# EAGLE design TimeBoard (EAGLE 8.5.2)
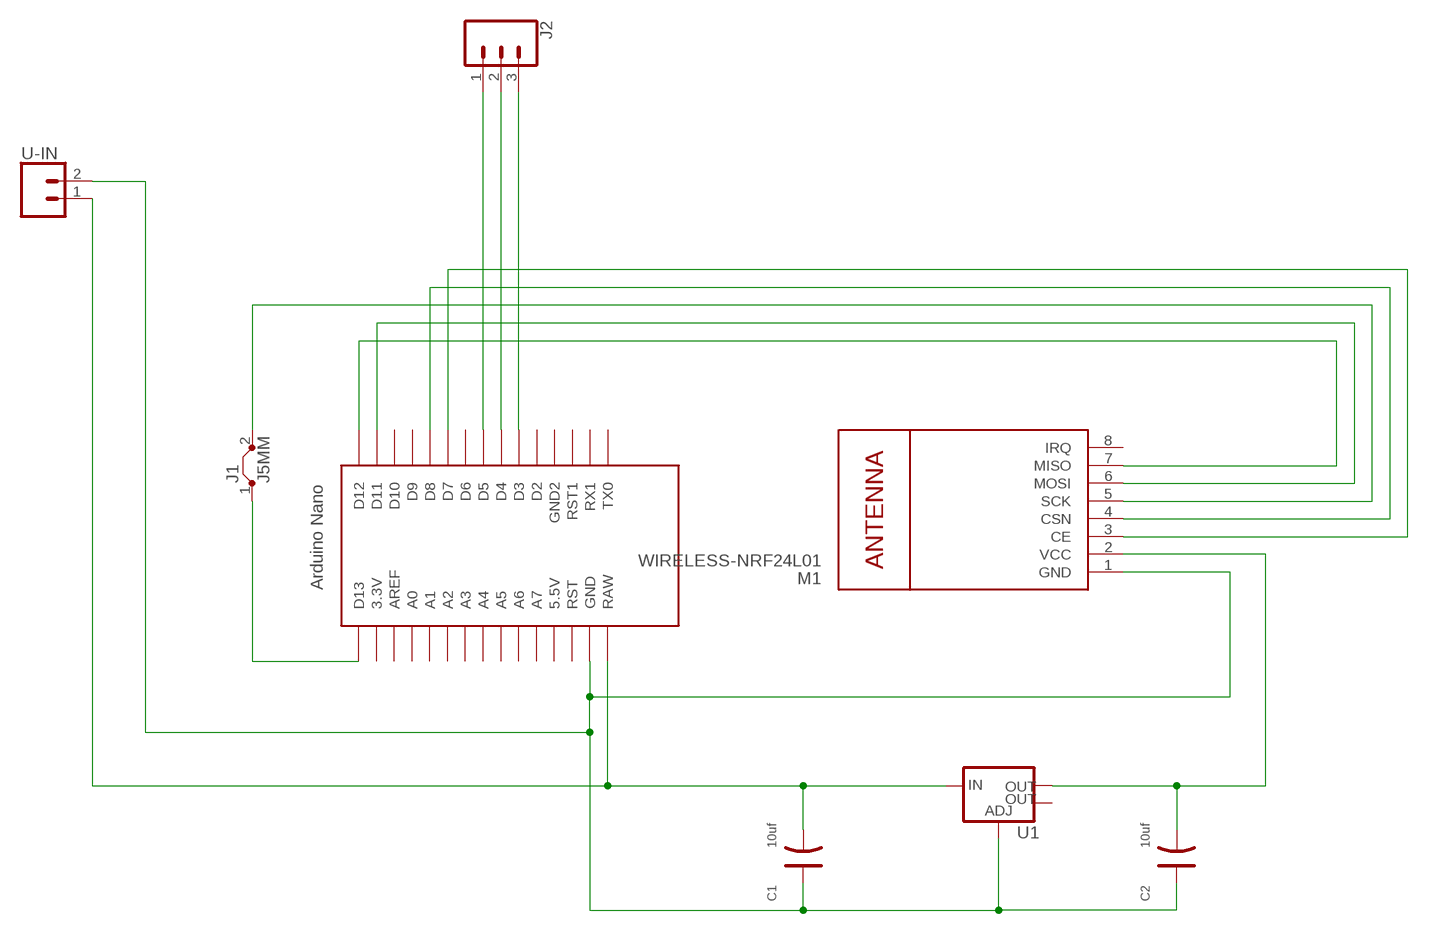
[diagram p0: schematic, sheet 1]

## Parts
C1  10uf  TANTALUM-SMD-10UF-16V-10%(AVX-B)  [AVX-B]
C2  10uf  TANTALUM-SMD-10UF-16V-10%(AVX-B)  [AVX-B]
J1  J5MM  [05]
J2  CONN_03-SCREW-5MM  [SCREWTERMINAL-5MM-3]
M1  WIRELESS-NRF24L01  [WIRELESS-NRF24L01]
U1  V_REG_LM1117SOT223  [SOT223]
U$1  NANO  [NANO]
U-IN  CONN_025MM  [SCREWTERMINAL-5MM-2]

## Nets
N$1: M1.4(CSN) U$1.D8
N$2: C1.+ C2.+ M1.1(GND) U1.1(ADJ) U$1.GND U-IN.2
N$3: C2.- M1.2(VCC) U1.2(OUT)
N$4: J1.2 M1.5(SCK)
N$5: J2.3 U$1.D3
N$6: J2.2 U$1.D4
N$7: J2.1 U$1.D5
N$11: C1.- U1.3(IN) U$1.RAW U-IN.1
N$15: M1.3(CE) U$1.D7
N$16: M1.6(MOSI) U$1.D11
N$17: M1.7(MISO) U$1.D12
N$21: J1.1 U$1.D13
Unconnected: M1.8(IRQ) U1.4(OUT) U$1.3.3V U$1.5V(5.5V) U$1.A0 U$1.A1 U$1.A2 U$1.A3 U$1.A4 U$1.A5 U$1.A6 U$1.A7 U$1.AREF U$1.D2 U$1.D6 U$1.D9 U$1.D10 U$1.GND1(GND2) U$1.ICSP1 U$1.ICSP2 U$1.ICSP3 U$1.ICSP4 U$1.ICSP5 U$1.ICSP6 U$1.RST U$1.RST1 U$1.RX1 U$1.TX0

## Library data of the parts
C1 C2 = Seeed-Capacitor:TANTALUM-SMD-10UF-16V-10%(AVX-B): 302020019; MPN: TAJB106K016RNJ
J1 = jumper:J: Bridge
J2 = SparkFun-Connectors:CONN_03: Multi connection point. Often used as Generic Header-pin footprint for 0.1 inch spaced/style header connections On any of the 0.1 inch spaced packages, you can populate with these: Break Away Headers - Straight <https://www.sparkfun.com/products/116> (PRT-00116) Break Away Male Headers - Right Angle <https://www.sparkfun.com/products/553> (PRT-00553) Female Headers <https://www.sparkfun.com/products/115> (PRT-00115) Break Away Headers - Machine Pin <https://www.sparkfun.com/products/117> (PRT-00117) Break Away Female Headers - Swiss Machine Pin <https://www.sparkfun.com/products/743> (PRT-00743) Stackable Header - 3 Pin (Female, 0.1") <https://www.sparkfun.com/products/13875> (PRT-13875) For SCREWTERMINALS and SPRING TERMINALS visit here: Screw Terimnals on SparkFun.com <https://www.sparkfun.com/search/results?term=Screw+Terminals> (5mm/3.5mm/2.54mm spacing) This device is also useful as a general connection point to wire up your design to another part of your project. Our various solder wires solder well into these plated through hole pads. Hook-Up Wire - Assortment (Stranded, 22 AWG) <https://www.sparkfun.com/products/11375> (PRT-11375) Hook-Up Wire - Assortment (Solid Core, 22 AWG) <https://www.sparkfun.com/products/11367> (PRT-11367) View the entire wire category on our website here <https://www.sparkfun.com/categories/141> Special notes: Molex polarized connector foot print use with SKU : PRT-08232 with associated crimp pins and housings.; PROD_ID: CONN-10134; SF_SKU: PRT-08433
M1 = diy-modules:WIRELESS-NRF24L01: 2.4 GHz Wireless Module based on NRF24L01 chip More details available here: http://www.electrodragon.com/w/NRF24L01 Click here to find device on ebay.com <http://www.ebay.com/sch/nrf24l01+arduino>
U1 = SparkFun-IC-Power:V_REG_LM1117: Voltage Regulator LM1117 Standard adjustable voltage regulator but in SMD form. Spark Fun Electronics SKU : COM-00595; PROD_ID: VREG-08170
U$1 = Arduino-clone:NANO: Arduino Nano
U-IN = SparkFun-Connectors:CONN_02: Multi connection point. Often used as Generic Header-pin footprint for 0.1 inch spaced/style header connections On any of the 0.1 inch spaced packages, you can populate with these: Break Away Headers - Straight <https://www.sparkfun.com/products/116> (PRT-00116) Break Away Male Headers - Right Angle <https://www.sparkfun.com/products/553> (PRT-00553) Female Headers <https://www.sparkfun.com/products/115> (PRT-00115) Break Away Headers - Machine Pin <https://www.sparkfun.com/products/117> (PRT-00117) Break Away Female Headers - Swiss Machine Pin <https://www.sparkfun.com/products/743> (PRT-00743) For SCREWTERMINALS and SPRING TERMINALS visit here: Screw Terimnals on SparkFun.com <https://www.sparkfun.com/search/results?term=Screw+Terminals> (5mm/3.5mm/2.54mm spacing) This device is also useful as a general connection point to wire up your design to another part of your project. Our various solder wires solder well into these plated through hole pads. Hook-Up Wire - Assortment (Stranded, 22 AWG) <https://www.sparkfun.com/products/11375> (PRT-11375) Hook-Up Wire - Assortment (Solid Core, 22 AWG) <https://www.sparkfun.com/products/11367> (PRT-11367) View the entire wire category on our website here <https://www.sparkfun.com/categories/141> Special notes: Molex polarized connector foot print use with: PRT-08233 with associated crimp pins and housings. 2.54_SCREWTERM for use with PRT-10571. 3.5mm Screw Terminal footprints for PRT-08084 5mm Screw Terminal footprints for use with PRT-08432; SF_SKU: PRT-08432

## Board
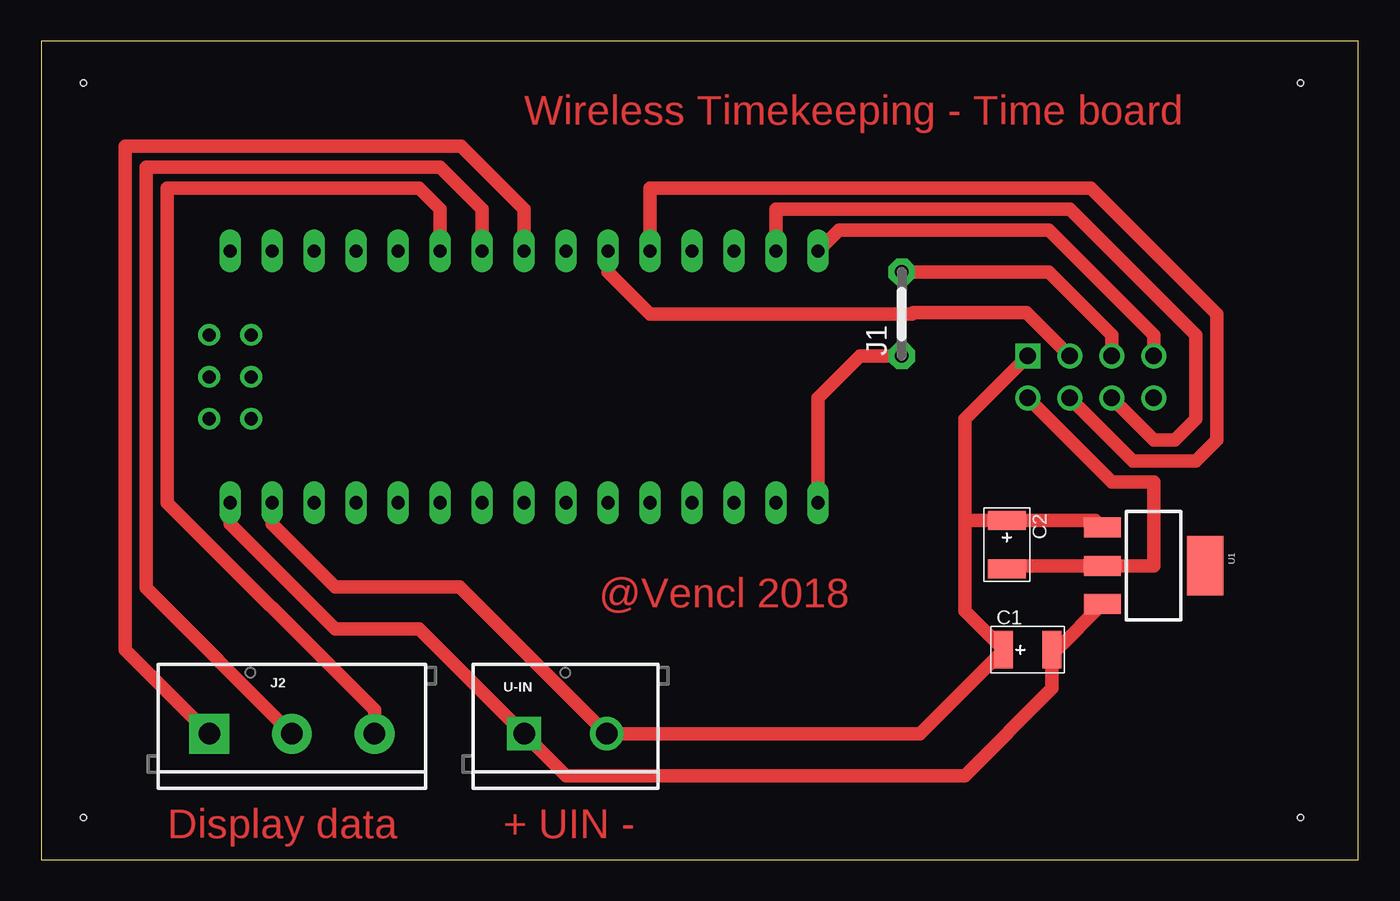
[diagram p1: board, top side]
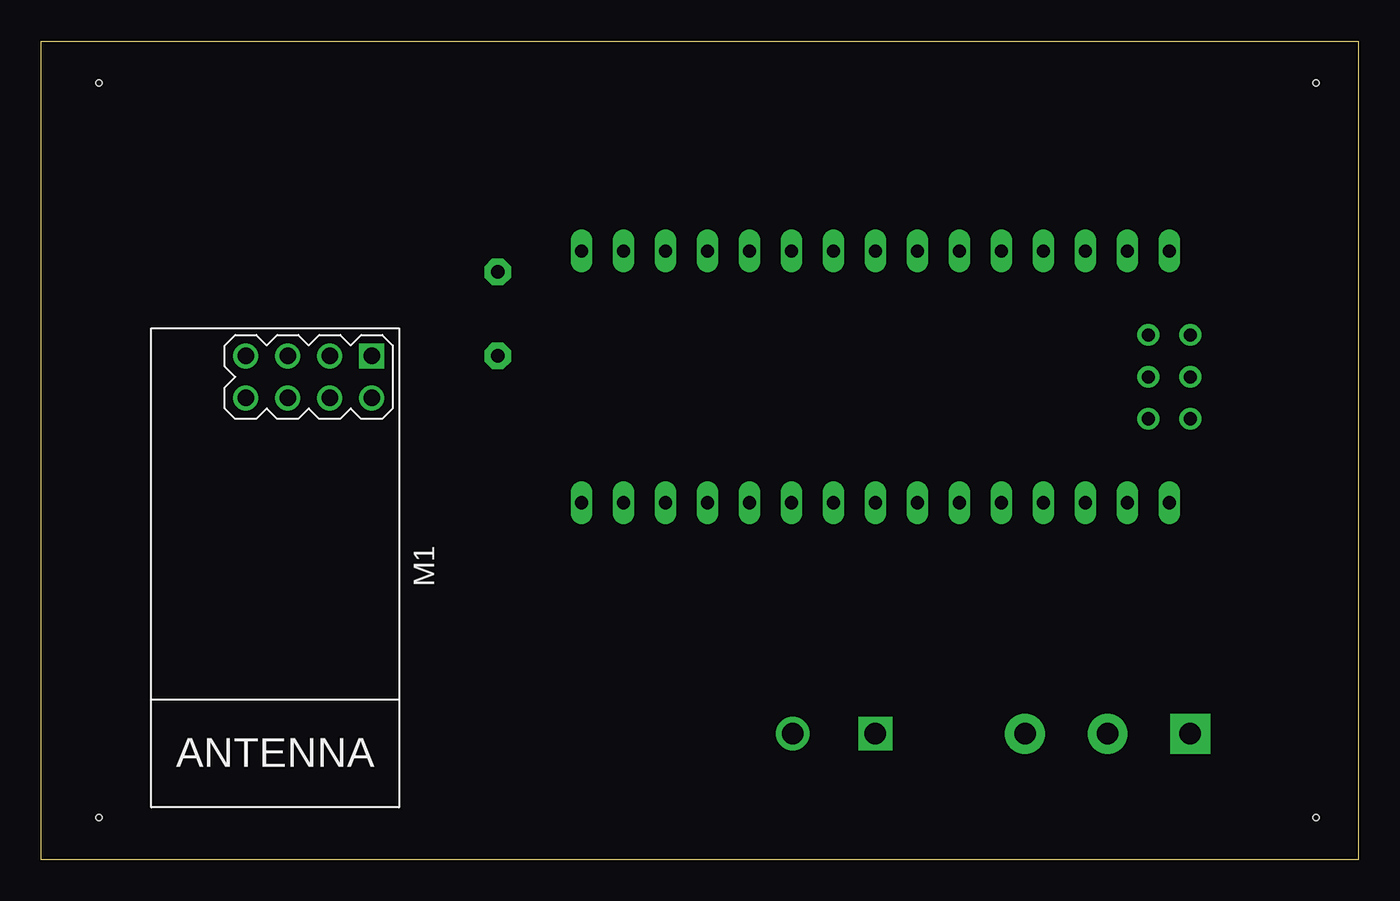
[diagram p2: board, bottom side, seen from below]

Size 79.68 x 49.52 mm. Coordinates in mm from the lower left corner, seen from the top.
Outline: 0,0 79.68,0 79.68,49.52 0,49.52 0,0
Copper layers (1*16): Top 0.035mm / dielectric 1.5mm / Bottom 0.035mm
Design rules "default": minimum track width 6mil, minimum drill 0.35mm, track to track 6mil, track to pad 6mil, pad to pad 6mil, via to via 6mil, smd to smd 6mil, copper to edge 40mil, drill to drill 6mil, minimum pad ring 10mil, minimum via ring 8mil, stop-mask expansion 4mil, vias tented up to drill 0mil, thermal gap 10mil
Holes 0.35 mm at 2.54,2.54 2.54,46.99 76.2,2.54 76.2,46.99

### Footprints (pad centres in the part's own frame; a part is rotated, then mirrored left to right if it is on the bottom)
AVX-B = smd 1.143 x 2.286: + -1.46,0; - 1.46,0
05 = drill 0.813 pad 1.6 octagon: 1 -2.54,0; 2 2.54,0
SCREWTERMINAL-5MM-3 = drill 1.3 pad 2.413 square: 1 0,0 | drill 1.3 pad 2.413: 2 5,0; 3 10,0
WIRELESS-NRF24L01 = drill 1 square: 1 -12.7,6.35 | drill 1: 2 -10.16,6.35; 3 -12.7,3.81; 4 -10.16,3.81; 5 -12.7,1.27; 6 -10.16,1.27; 7 -12.7,-1.27; 8 -10.16,-1.27
SOT223 = smd 1.219 x 2.235: 1 -2.311,-3.099; 2 0,-3.099; 3 2.311,-3.099 | smd 3.6 x 2.2: 4 0,3.099
NANO = drill 0.8 long: 3.3V -10.16,24.13; 5V -10.16,-1.27; A0 -10.16,19.05; A1 -10.16,16.51; A2 -10.16,13.97; A3 -10.16,11.43; A4 -10.16,8.89; A5 -10.16,6.35; A6 -10.16,3.81; A7 -10.16,1.27; AREF -10.16,21.59; D2 5.08,1.27; D3 5.08,3.81; D4 5.08,6.35; D5 5.08,8.89; D6 5.08,11.43; D7 5.08,13.97; D8 5.08,16.51; D9 5.08,19.05; D10 5.08,21.59; D11 5.08,24.13; D12 5.08,26.67; D13 -10.16,26.67; GND -10.16,-6.35; GND1 5.08,-1.27; RAW -10.16,-8.89; RST -10.16,-3.81; RST1 5.08,-3.81; RX1 5.08,-6.35; TX0 5.08,-8.89 | drill 0.8: ICSP1 -5.08,-10.16; ICSP2 -5.08,-7.62; ICSP3 -2.54,-10.16; ICSP4 -2.54,-7.62; ICSP5 0,-10.16; ICSP6 0,-7.62
SCREWTERMINAL-5MM-2 = drill 1.3 pad 2.032 square: 1 0,0 | drill 1.3 pad 2.032: 2 5,0

### Placement (x,y rotation side)
C1  59.69,12.7 0 top
C2  58.42,19.05 270 top
J1  52.07,33.02 90 top
J2  10.16,7.62 0 top
M1  66.04,17.78 270 bottom
U1  67.31,17.78 270 top
U$1  20.32,31.75 90 bottom
U-IN  29.21,7.62 0 top

### Tracks (layer width: path | path; a pad name or v marks a point on that pad's centre or on a via)
N$1
  Top 0.813: U$1.D8 36.83,40.64 63.5,40.64 71.12,33.02 71.12,25.4 69.85,24.13 66.04,24.13 M1.4
N$2
  Top 0.813: U$1.GND 13.97,20.32 17.78,16.51 25.32,16.51 U-IN.2 53.15,7.62 C1.+ 55.88,15.05 55.88,20.32 | M1.1 55.88,26.67 55.88,20.32 | 55.88,20.32 56.07,20.51 C2.+ 63.79,20.51 U1.1
N$3
  Top 0.813: M1.2 64.77,22.86 67.31,22.86 67.31,17.78 U1.2 58.42,17.78 C2.-
N$4
  Top 0.813: J1.2 60.96,35.56 64.77,31.75 M1.5
N$5
  Top 0.813: U$1.D3 24.13,39.37 22.86,40.64 7.62,40.64 7.62,21.59 20.16,9.05 J2.3
N$6
  Top 0.813: U$1.D4 26.67,39.37 24.13,41.91 6.35,41.91 6.35,16.43 J2.2
N$7
  Top 0.813: U$1.D5 29.21,39.37 25.4,43.18 5.08,43.18 5.08,12.7 J2.1
N$11
  Top 0.813: U$1.RAW 11.43,20.32 17.78,13.97 22.86,13.97 U-IN.1 31.75,5.08 55.88,5.08 61.15,10.35 C1.- 61.44,12.7 U1.3
N$15
  Top 0.813: M1.3 59.6,33.11 52.78,33.11 52.69,33.02 36.83,33.02 34.29,35.56 U$1.D7
N$16
  Top 0.813: U$1.D11 44.45,39.37 62.23,39.37 69.85,31.75 69.85,26.67 68.58,25.4 67.31,25.4 M1.6
N$17
  Top 0.813: M1.7 67.31,31.75 60.96,38.1 48.26,38.1 U$1.D12
N$21
  Top 0.813: J1.1 49.53,30.48 46.99,27.94 U$1.D13

### Text on the board
Top: Wireless Timekeeping - Time board | @Vencl 2018 | Display data | + UIN -